# Altium schematic sheet OTHER.SchDoc
size A3; SheetNumber: 3; SheetTotal: 5
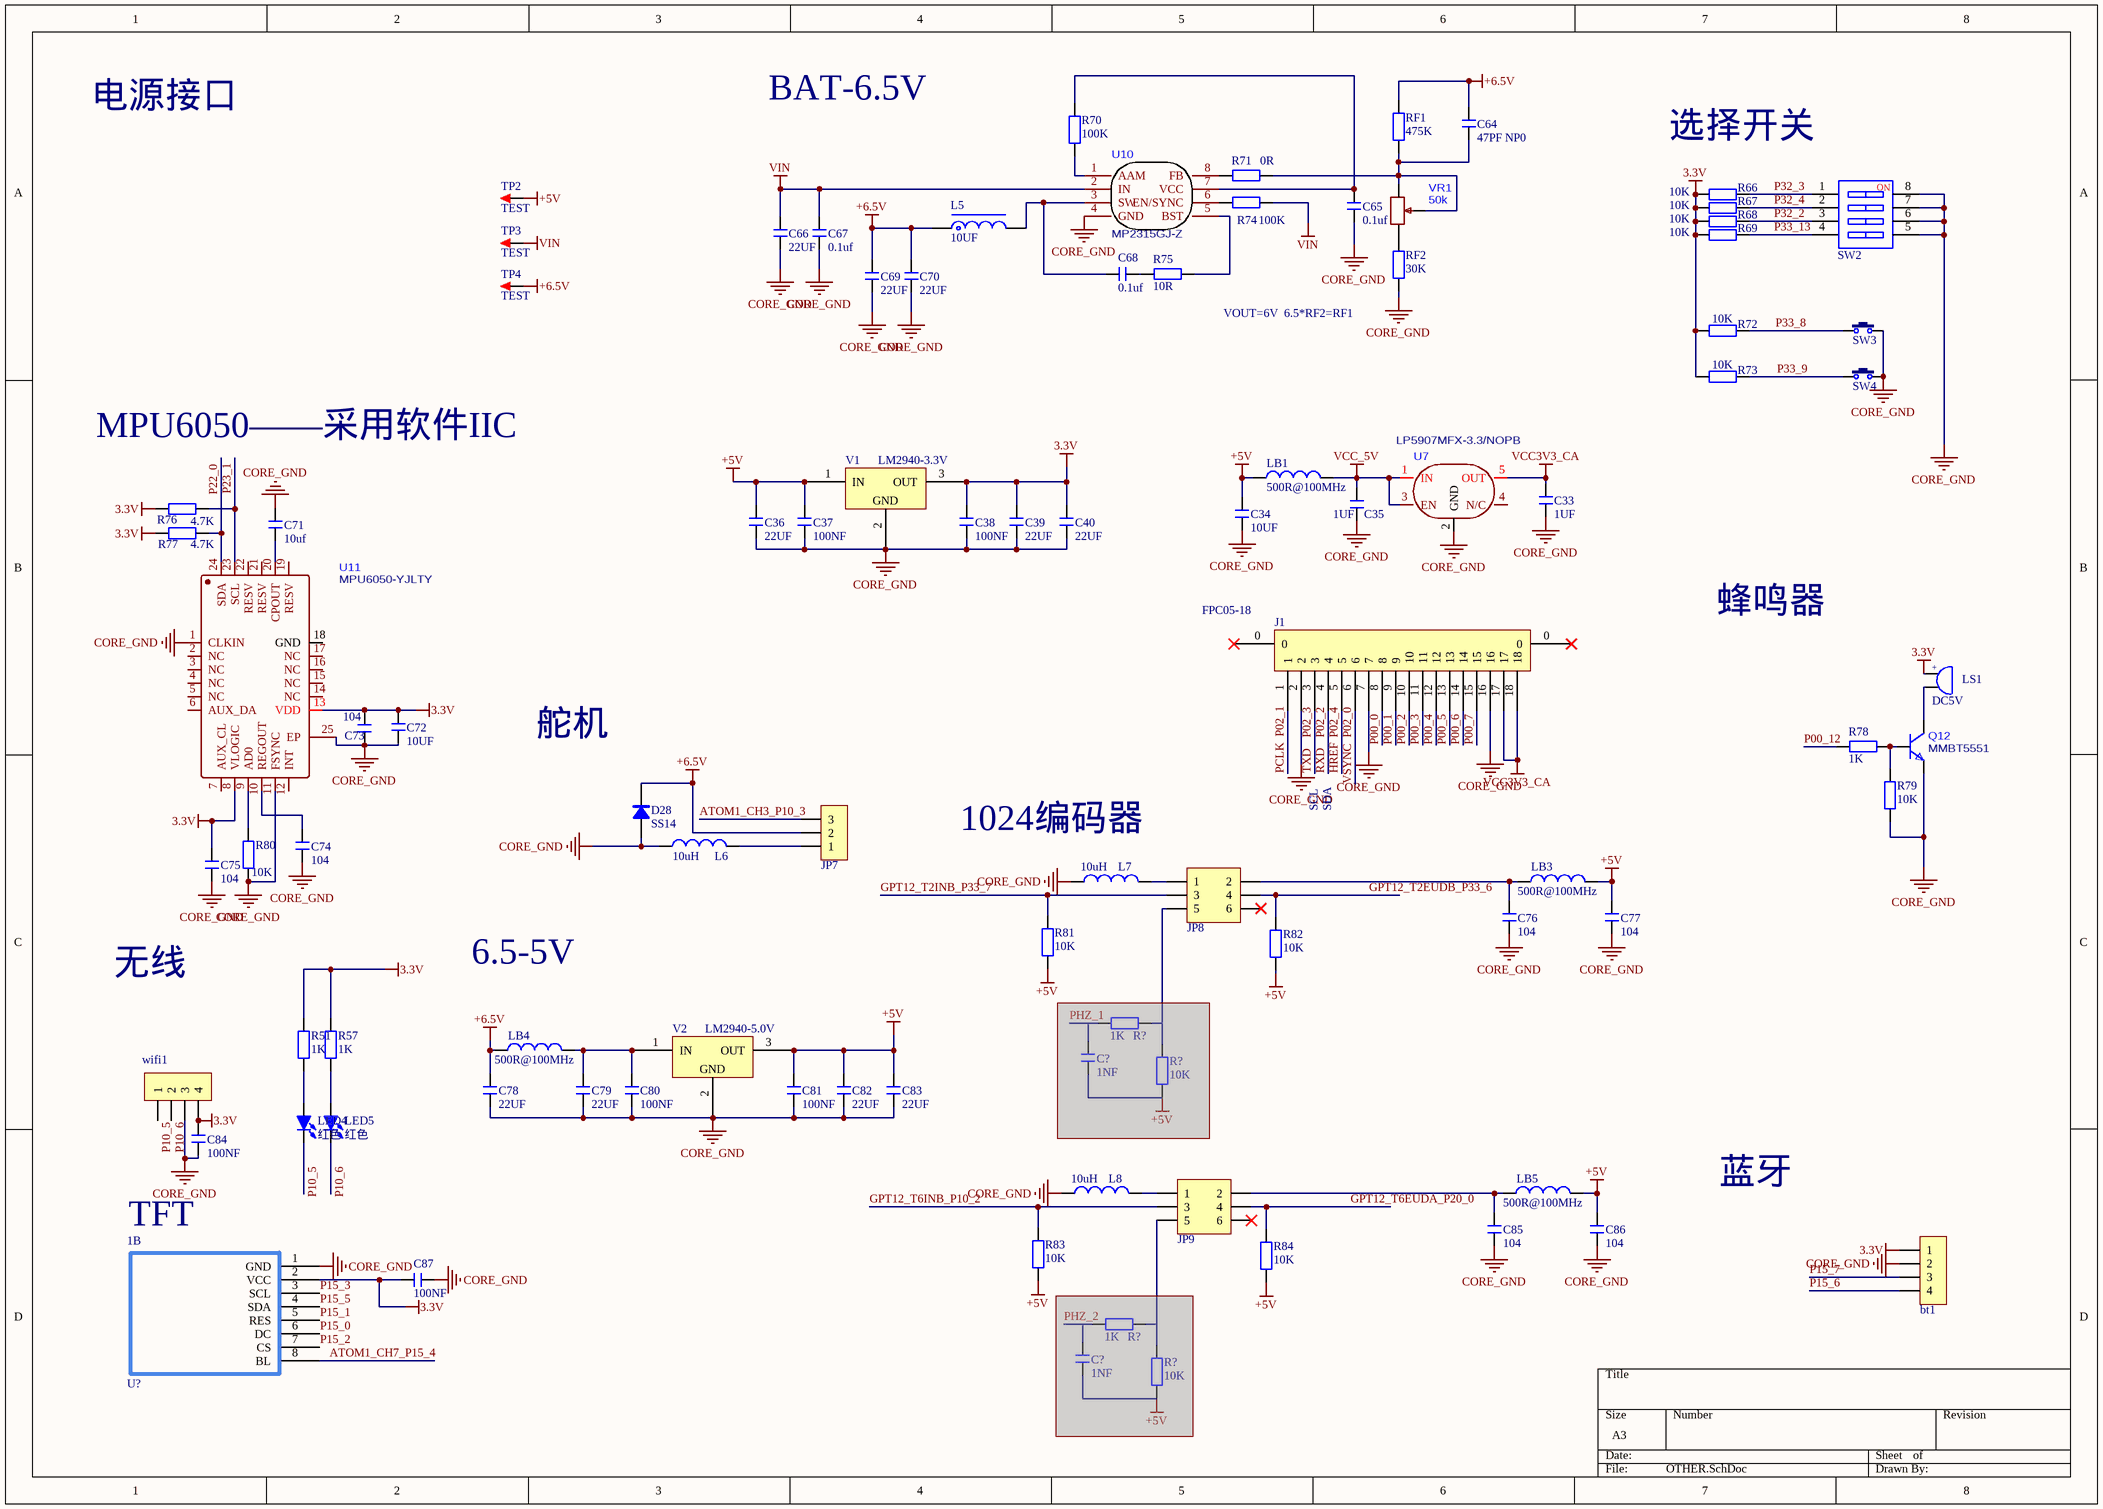
[diagram p0: OTHER.SchDoc]

## Parts
(Parts that share a designator on the sheet are numbered #1, #2 ... from top to bottom, then left to right.)
1  U?  [1.8'TFT]  (part B of 2)
bt1  HDR-1X4  [HDR2.54-LI-4P]  (value not drawn)
C33  1UF  [C 0805_L]
C34  10UF  [C 0805_L]
C35  1UF  [C 0805_L]
C36  22UF  [C 0805_L]
C37  100NF  [C 0805_L]
C38  100NF  [C 0805_L]
C39  22UF  [C 0805_L]
C40  22UF  [C 0805_L]
C64  47PF NP0  [C 0805_L]
C65  0.1uf  [C 0805_L]
C66  22UF  [C 0805_L]
C67  0.1uf  [C 0805_L]
C68  0.1uf  [C 0805_L]
C69  22UF  [C 0805_L]
C70  22UF  [C 0805_L]
C71  10uf  [C 0805_L]
C72  10UF  [C 0805_L]
C73  104  [C 0805_L]
C74  104  [C 0805_L]
C75  104  [C 0805_L]
C76  104  [C 0805_L]
C77  104  [C 0805_L]
C78  22UF  [C 0805_L]
C79  22UF  [C 0805_L]
C80  100NF  [C 0805_L]
C81  100NF  [C 0805_L]
C82  22UF  [C 0805_L]
C83  22UF  [C 0805_L]
C84  100NF  [C 0805_L]
C85  104  [C 0805_L]
C86  104  [C 0805_L]
C87  100NF  [C 0805_L]
C?#1  1NF  [C 0603_L]  (masked out: inside a compile mask, not in the netlist)
C?#2  1NF  [C 0603_L]  (masked out: inside a compile mask, not in the netlist)
D28  SS14  [SMA]
J1  FPC05-18  [FPC-05-18]
JP7  HDR-1X3  [XH2.54-LI-3P]  (value not drawn)
JP8  Header3X2  [IDC2.54-LI-2x3P]  (value not drawn)
JP9  Header3X2  [IDC2.54-LI-2x3P]  (value not drawn)
L5  10UF  [L-SMD-0630]
L6  10uH  [L 0805_L]
L7  10uH  [L 0805_L]
L8  10uH  [L 0805_L]
LB1  500R@100MHz  [FB 0805_L]
LB3  500R@100MHz  [FB 0805_L]
LB4  500R@100MHz  [FB 0805_L]
LB5  500R@100MHz  [FB 0805_L]
LED4  红色  [LED 0603Y]
LED5  红色  [LED 0603Y]
LS1  DC5V  [BEEP 5x9x5.5]
Q12  MMBT5551  [SOT23-3L]
R51  1K  [R 0603_L]
R57  1K  [R 0603_L]
R66  10K  [R 0805_L]
R67  10K  [R 0805_L]
R68  10K  [R 0805_L]
R69  10K  [R 0805_L]
R70  100K  [R 0805_L]
R71  0R  [R 0805_L]
R72  10K  [R 0805_L]
R73  10K  [R 0805_L]
R74  100K  [R 0805_L]
R75  10R  [R 0805_L]
R76  4.7K  [R 0805_L]
R77  4.7K  [R 0805_L]
R78  1K  [R 0805_L]
R79  10K  [R 0805_L]
R80  10K  [R 0805_L]
R81  10K  [R 0805_L]
R82  10K  [R 0805_L]
R83  10K  [R 0805_L]
R84  10K  [R 0805_L]
R?#1  1K  [R 0603_L]  (masked out: inside a compile mask, not in the netlist)
R?#2  10K  [R 0603_L]  (masked out: inside a compile mask, not in the netlist)
R?#3  1K  [R 0603_L]  (masked out: inside a compile mask, not in the netlist)
R?#4  10K  [R 0603_L]  (masked out: inside a compile mask, not in the netlist)
RF1  475K  [R 0805_L]
RF2  30K  [R 0805_L]
SW2  CSW-4P  [CSW DIP-4P]  (value not drawn)
SW3  3x6x5  [TSW SMD-3*6*2.5]  (value not drawn)
SW4  3x6x5  [TSW SMD-3*6*2.5]  (value not drawn)
TP2  TEST  [TEST 1.6]
TP3  TEST  [TEST 1.6]
TP4  TEST  [TEST 1.6]
U7  LP5907MFX-3.3/NOPB  [SOT23-5L]
U10  MP2315GJ-Z  [TSOT-23-8]
U11  MPU6050-YJLTY  [QFN-24_L4.0-W4.0-P0.50-BL-EP2.7]
V1  LM2940-3.3V  [SOT223_L]
V2  LM2940-5.0V  [TO263-3A]
VR1  50k  [RES-ADJ-SMD_3224W]
wifi1  HDR-1X4  [HDR2.54-LI-4P]  (value not drawn)

## Nets
3.3V: 1.2(VCC) bt1.1 C38.2 C39.2 C40.2 C72.2 C73.2 C75.2 C84.1 C87.2 LS1.1 R51.2 R57.2 R66.1 R67.1 R68.1 R69.1 R72.1 R73.1 R76.2 R77.2 U11.8(VLOGIC) U11.13(VDD) V1.3(OUT) wifi1.4
+5V: C34.1 C36.2 C37.2 C77.2 C81.2 C82.2 C83.2 C86.2 LB1.1 LB3.2 LB5.2 R81.2 R82.2 R83.2 R84.2 TP2.1 V1.1(IN) V2.3(OUT)
+6.5V: C64.1 C69.1 C70.1 C78.2 D28.2(K) JP7.2 L5.1 LB4.1 RF1.2 TP4.1
CORE_GND: 1.1(GND) bt1.2 C33.2 C34.2 C35.2 C36.1 C37.1 C38.1 C39.1 C40.1 C65.2 C66.2 C67.2 C69.2 C70.2 C71.2 C72.1 C73.1 C74.1 C75.1 C76.1 C77.1 C78.1 C79.1 C80.1 C81.1 C82.1 C83.1 C84.2 C85.1 C86.1 C87.1 D28.1(A) J1.2 J1.7 J1.16 L6.1 L7.1 L8.1 Q12.2(E) R79.2 R80.1 RF2.1 SW2.5 SW2.6 SW2.7 SW2.8 SW3.2 SW4.2 U7.2(GND) U10.4(GND) U11.1(CLKIN) U11.11(FSYNC) U11.25(EP) V1.2(GND) V2.2(GND) wifi1.3
VCC3V3_CA: C33.1 J1.17 J1.18 U7.5(OUT)
VCC_5V: C35.1 LB1.2 U7.1(IN) U7.3(EN)
VIN: C66.1 C67.1 R74.2 TP3.1 U10.2(IN)
ATOM1_CH3_P10_3: JP7.3
ATOM1_CH7_P15_4: 1.8(BL)
GPT12_T2EUDB_P33_6: JP8.4 R82.1
GPT12_T2INB_P33_7: JP8.3 R81.1
GPT12_T6EUDA_P20_0: JP9.4 R84.1
GPT12_T6INB_P10_2: JP9.3 R83.1
HREF: J1.5  [also labelled P02_4]
P00_0: J1.8
P00_1: J1.9
P00_2: J1.10
P00_3: J1.11
P00_4: J1.12
P00_5: J1.13
P00_6: J1.14
P00_7: J1.15
P00_12: R78.2
P02_0: J1.6  [also labelled VSYNC]
P02_1: J1.1  [also labelled PCLK]
P02_2: J1.4  [also labelled RXD]
P02_3: J1.3  [also labelled TXD]
P10_5: LED4.2(K) wifi1.1
P10_6: LED5.2(K) wifi1.2
P15_0: 1.6(DC)
P15_1: 1.5(RES)
P15_2: 1.7(CS)
P15_3: 1.3(SCL)
P15_5: 1.4(SDA)
P15_6: bt1.4
P15_7: bt1.3
P22_0: R77.1 U11.24(SDA)
P23_1: R76.1 U11.23(SCL)
P32_2: R68.2 SW2.3
P32_3: R66.2 SW2.1
P32_4: R67.2 SW2.2
P33_8: R72.2 SW3.1
P33_9: R73.2 SW4.1
P33_13: R69.2 SW2.4
NetC64_2: C64.2 R71.2 RF1.1 VR1.2 VR1.3
NetC65_1: C65.1 R70.2 U10.7(VCC)
NetC68_1: C68.1 R75.2
NetC68_2: C68.2 L5.2 U10.3(SW)
NetC71_1: C71.1 U11.20(CPOUT)
NetC74_2: C74.2 U11.10(REGOUT)
NetC76_2: C76.2 JP8.2 LB3.1
NetC79_2: C79.2 C80.2 LB4.2 V2.1(IN)
NetC85_2: C85.2 JP9.2 LB5.1
NetJP7_1: JP7.1 L6.2
NetJP8_1: JP8.1 L7.2
NetJP9_1: JP9.1 L8.2
NetLED4_1: LED4.1(A) R51.1
NetLED5_1: LED5.1(A) R57.1
NetLS1_2: LS1.2 Q12.3(C)
NetQ12_1: Q12.1(B) R78.1 R79.1
NetR70_1: R70.1 U10.1(AAM)
NetR71_1: R71.1 U10.8(FB)
NetR74_1: R74.1 U10.6(EN/SYNC)
NetR75_1: R75.1 U10.5(BST)
NetR80_2: R80.2 U11.9(AD0)
NetRF2_2: RF2.2 VR1.1

Not connected (* = marked no-connect by the designer): J1 0*; JP8 5 6*; JP9 5 6*; U7 4(N/C); U11 2(NC) 3(NC) 4(NC) 5(NC) 6(AUX_DA) 7(AUX_CL) 12(INT) 14(NC) 15(NC) 16(NC) 17(NC) 18(GND) 19(RESV) 21(RESV) 22(RESV)

## Notes on the sheet
- 电源接口
- BAT-6.5V
- 选择开关
- VOUT=6V  6.5*RF2=RF1
- MPU6050——采用软件IIC
- 蜂鸣器
- 舵机
- (near L7) 1024编码器
- SCL
- SDA
- 无线
- 6.5-5V
- 蓝牙
- TFT
- (in symbol BEEP) +
- (in symbol CSW-4P) NO

## Library data of the parts
1 = 1.8'TFT
bt1 wifi1 = Header 4: 4P接插件; 版权归属: 源创客; BOM名称: 4P接插件; 学习资源: www.ooocke.com
C33-C40 C64-C87 C?#1 C?#2 = C: 无极性贴片电容; 版权归属: 源创客; 材质: X7R; BOM名称: 无极性贴片电容; 学习资源: www.ooocke.com
D28 = SS24: 肖特基二极管; 版权归属: 源创客; 属性: 40V/2A; BOM名称: 肖特基二极管; 学习资源: www.ooocke.com
JP7 = Header 3: 3P接插件; 版权归属: 源创客; BOM名称: 3P接插件; 学习资源: www.ooocke.com
JP8 JP9 = Header 3X2: 3*2P接插件; 版权归属: 源创客; BOM名称: 3*2P接插件; 学习资源: www.ooocke.com
L5 = L-CDRH: 功率屏蔽电感; 版权归属: 源创客; BOM名称: 功率屏蔽电感; 学习资源: www.ooocke.com
L6-L8 = L: 小功率贴片电感; 版权归属: 源创客; BOM名称: 小功率贴片电感; 学习资源: www.ooocke.com
LB1 LB3-LB5 = LB: 磁珠; 版权归属: 源创客; BOM名称: 磁珠; 学习资源: www.ooocke.com
LED4 LED5 = LED-SMD: 贴片LED; 版权归属: 源创客; BOM名称: 贴片LED; 学习资源: www.ooocke.com
LS1 = BEEP: 蜂鸣器; 版权归属: 源创客; BOM名称: 蜂鸣器; 学习资源: www.ooocke.com
R51 R57 R66-R84 R?#1-R?#4 RF1 RF2 = R: 贴片电阻; 版权归属: 源创客; BOM名称: 贴片电阻; 学习资源: www.ooocke.com
SW2 = CSW-4P: 4路编码开关; 版权归属: 源创客; BOM名称: 4路编码开关; 学习资源: www.ooocke.com
SW3 SW4 = TSW 3x6: 3x6轻触开关; 版权归属: 源创客; BOM名称: 3x6轻触开关; 学习资源: www.ooocke.com
TP2-TP4 = TEST: 测试点; 版权归属: 源创客; BOM名称: 测试点; 学习资源: www.ooocke.com
U7 = LP5907MFX-1.8/NOPB
V1 V2 = LM2940: 5V稳压芯片; 版权归属: 源创客; BOM名称: 5V稳压芯片; 学习资源: www.ooocke.com
VR1 = 3224W-1-503E